# Altium project PCB_Project_3.PrjPcb
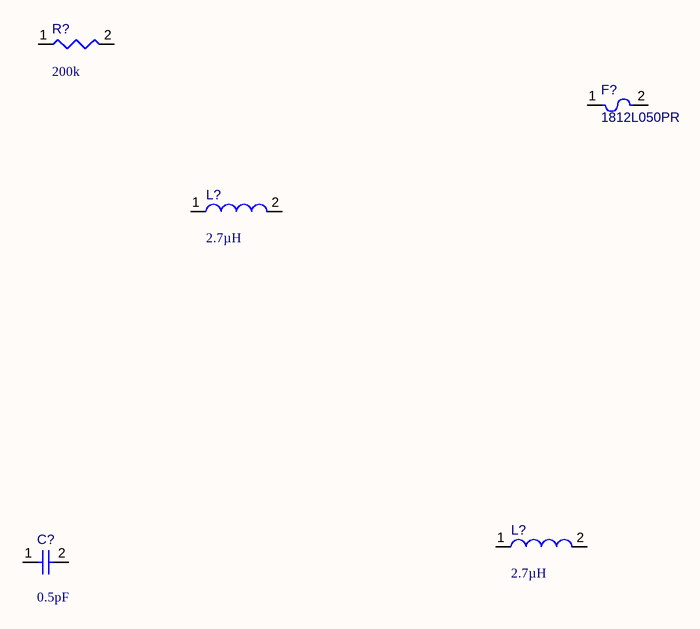
[diagram p0: Sheet1.SchDoc]
1 sheet, 5 parts. Net scope: global (net labels, ports and power ports of the same name join across sheets).
Board file: PCB1.PcbDoc

## Sheet Sheet1.SchDoc
size A

### Parts
(Parts that share a designator on the sheet are numbered #1, #2 ... from top to bottom, then left to right.)
C?  value 0.5pF  [CAPC1005X56X25ML10T15]  (hidden comment: Capacitor 0.5 pF +/- 0.1pF 25 V 0402)
F?  1812L050PR  [LFUS-1812L050_V]
L?#1  value 2.7µH  [TDK-VLCF5028-2_V]  (hidden comment: VLCF5028T-2R7N1R8-2)
L?#2  value 2.7µH  [TDK-VLCF5028-2_V]  (hidden comment: VLCF5028T-2R7N1R8-2)
R?  value 200k  [RESC0402(1005)_L]  (hidden comment: Resistor 200K +/-1 % 0402 63 mW)

### Nets

Not connected (* = marked no-connect by the designer): C? 1 2; F? 1 2; L?#1 1 2; L?#2 1 2; R? 1 2

### Library data of the parts
C? = CMP-001-00002-4: Chip Capacitor, 0.5 pF, +/- 0.1pF, 25 V, 0402 (1005 Metric); Capacitor Type: Ceramic; Tolerance: 20%; Voltage Rating: 25V; Case/Package: 0402; Max Operating Temperature: 125°C; RoHS Compliant: True; Min Operating Temperature: -55°C; Mounting Technology: SM; Pins: 2
F? = CMP-005-00004-3: POLY-FUSE(R) Resettable PTC, 15 V, 0.5 A, -40 to 85 degC, 2-Pin SMD, RoHS, Tape and Reel; Manufacturer: Littelfuse; Nominal Supply Voltage: 15V; Resistance: 1Ohm; Current Rating: 100A; Min Operating Temperature: -40°C; Package Description: 2-Pin Surface Mount Device, Body 4.55 x 3.24 mm; Package Quantity: 1; RoHS Compliant: True; Datasheet Version: Feb-16; Datasheet URL: http://www.littelfuse.com/~/media/electronics/datasheets/resettable_ptcs/littelfuse_ptc_1812l_datasheet.pdf.pdf; Case/Package: 1812; Packaging: TapeandReel; Voltage Rating: 15V; Max Operating Temperature: 85°C; Package Reference: 1812; Mounting Technology: SM
L?#1 L?#2 = CMP-006-00017-4: Inductor for Power Circuits, 2.7 uH, +/- 30%,100 KHz, 1.82 A, -40 to 105 degC, 2-Pin SMD, RoHS, Reel; Manufacturer: TDK; Shielding: Shielded; Core Material: Ferrite; Resistance: 0.033Ohm; Saturation Current: 1.82A; Package Quantity: 500; Datasheet URL: https://product.tdk.com/info/en/catalog/datasheets/inductor_commercial_power_vlcf5028-2_en.pdf; Inductance Tolerance: 30%; Datasheet Version: Apr-16; Packaging: TapeandReel; Case/Package: 5028; Package Reference: VLCF5028-2; Tolerance: 30%; Max Operating Temperature: 105°C; RoHS Compliant: True; Min Operating Temperature: -40°C; Mounting Technology: SM; Package Description: 2-Pin Surface Mount Device, Body 5.2 x 5.3 mm; Current Rating: 1.82A
R? = CMP-009-00163-2: Chip Resistor, 200 kOhms, +/-1 %, 63 mW, -55 to 155 degC, 0402; Tolerance: 1%; Power: 63mW; Pins: 2; Case/Package: 0402; Max Operating Temperature: 155°C; Min Operating Temperature: -55°C